# Altium schematic sheet ESC2.SchDoc: ESC
size A4; DrawnBy: BRAIN.DLL; DocumentNumber: 2; Revision: REV 1.0; SheetNumber: 2; SheetTotal: 2
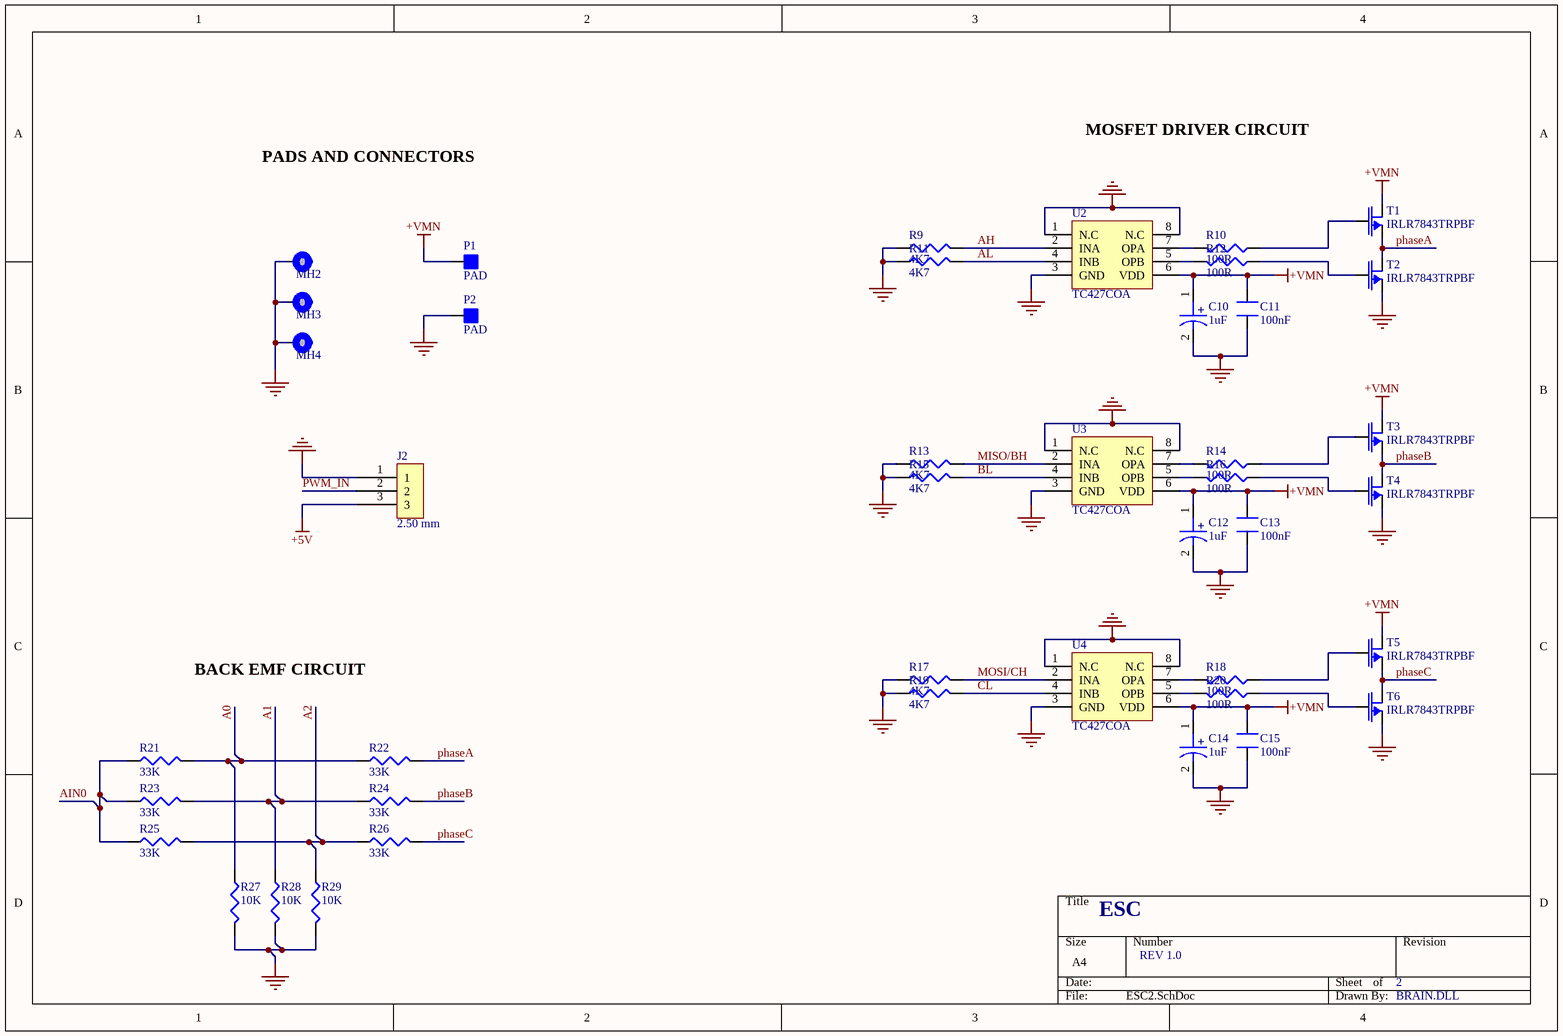
[diagram p0: ESC2.SchDoc]

## Parts
C10  1uF  [1206 TANTAL CAP]
C11  100nF  [Z0603]
C12  1uF  [1206 TANTAL CAP]
C13  100nF  [Z0603]
C14  1uF  [1206 TANTAL CAP]
C15  100nF  [Z0603]
J2  2.50 mm  [L-KLS1-XL4-2.50-03-R]
MH2  MH_7.4MMC_3.2MMD  [MH_7.4MMC_3.2MMD_NON_COPPER_NPLT]  (value not drawn)  (no BOM)
MH3  MH_7.4MMC_3.2MMD  [MH_7.4MMC_3.2MMD_NON_COPPER_NPLT]  (value not drawn)  (no BOM)
MH4  MH_7.4MMC_3.2MMD  [MH_7.4MMC_3.2MMD_NON_COPPER_NPLT]  (value not drawn)  (no BOM)
P1  PAD  [SQARE_PAD]  (no BOM)
P2  PAD  [SQARE_PAD]  (no BOM)
R9  4K7  [Z0603]
R10  100R  [Z0603]
R11  4K7  [Z0603]
R12  100R  [Z0603]
R13  4K7  [Z0603]
R14  100R  [Z0603]
R15  4K7  [Z0603]
R16  100R  [Z0603]
R17  4K7  [Z0603]
R18  100R  [Z0603]
R19  4K7  [Z0603]
R20  100R  [Z0603]
R21  33K  [Z0603]
R22  33K  [Z0603]
R23  33K  [Z0603]
R24  33K  [Z0603]
R25  33K  [Z0603]
R26  33K  [Z0603]
R27  10K  [Z0603]
R28  10K  [Z0603]
R29  10K  [Z0603]
T1  IRLR7843TRPBF  [TO-252-3]
T2  IRLR7843TRPBF  [TO-252-3]
T3  IRLR7843TRPBF  [TO-252-3]
T4  IRLR7843TRPBF  [TO-252-3]
T5  IRLR7843TRPBF  [TO-252-3]
T6  IRLR7843TRPBF  [TO-252-3]
U2  TC427COA  [SOIC-8]
U3  TC427COA  [SOIC-8]
U4  TC427COA  [SOIC-8]

## Nets
+5V: J2.3
+VMN: C10.1 C11.1 C12.1 C13.1 C14.1 C15.1 P1.1 T1.2(DRAIN) T3.2(DRAIN) T5.2(DRAIN) U2.6(VDD) U3.6(VDD) U4.6(VDD)
GND: C10.2 C11.2 C12.2 C13.2 C14.2 C15.2 J2.1 MH2.1 MH3.1 MH4.1 P2.1 R9.1 R11.1 R13.1 R15.1 R17.1 R19.1 R27.2 R28.2 R29.2 T2.3(SOURCE) T4.3(SOURCE) T6.3(SOURCE) U2.1(N.C) U2.3(GND) U2.8(N.C) U3.1(N.C) U3.3(GND) U3.8(N.C) U4.1(N.C) U4.3(GND) U4.8(N.C)
A0: R21.2 R22.1 R27.1
A1: R23.2 R24.1 R28.1
A2: R25.2 R26.1 R29.1
AH: R9.2 U2.2(INA)
AIN0: R21.1 R23.1 R25.1
AL: R11.2 U2.4(INB)
BL: R15.2 U3.4(INB)
CL: R19.2 U4.4(INB)
MISO/BH: R13.2 U3.2(INA)
MOSI/CH: R17.2 U4.2(INA)
phaseA: R22.2 T1.3(SOURCE) T2.2(DRAIN)
phaseB: R24.2 T3.3(SOURCE) T4.2(DRAIN)
phaseC: R26.2 T5.3(SOURCE) T6.2(DRAIN)
PWM_IN: J2.2
NetR10_1: R10.1 T1.1(GATE)
NetR10_2: R10.2 U2.7(OPA)
NetR12_1: R12.1 T2.1(GATE)
NetR12_2: R12.2 U2.5(OPB)
NetR14_1: R14.1 T3.1(GATE)
NetR14_2: R14.2 U3.7(OPA)
NetR16_1: R16.1 T4.1(GATE)
NetR16_2: R16.2 U3.5(OPB)
NetR18_1: R18.1 T5.1(GATE)
NetR18_2: R18.2 U4.7(OPA)
NetR20_1: R20.1 T6.1(GATE)
NetR20_2: R20.2 U4.5(OPB)

## Notes on the sheet
- PADS AND CONNECTORS
- MOSFET DRIVER CIRCUIT
- BACK EMF CIRCUIT
- (in symbol T491A105K035AT) +

## Library data of the parts
C10 C12 C14 = T491A105K035AT: Cap Tant Solid 1uF 35V A CASE 10% (3.2 X 1.6 X 1.6mm) SMD 3216-18 7.5 Ohm 125 C T/R; Manufacturer: KEMET; Dielectric Material: Tantalum; Tolerance: 20%; ESR (Equivalent Series Resistance): 7.5R; Life (Hours): 2000Hour; Dissipation Factor: 4%; Polarity: Polar; Ripple Current: 100mA; Leakage Current: 500nA; Voltage: 25V; OZDISAN_PRICE: 1.78 TRY; Supplier 1: Digi-Key; Manufacturer Part Number: T491A105K035AT; RoHS: Yes; Category: Tantalum Capacitors; Stock 1: 48; Pricing 1: 1=0,53000, 10=0,37100, 50=0,26000, 100=0,22290, 500=0,16716, 1000=0,14115 (USD); Mount: Surface Mount,PCB; Case/Package: 1206; Number of Pins: 2; Case Code (Metric): 3216; Case Code (Imperial): 1206; Min Operating Temperature: -55°C; Max Operating Temperature: 125°C; Capacitance: 1uF; Packaging: Tape and Reel; Voltage Rating: 35V; Features: General Purpose; Package Quantity: 1; Voltage Rating (DC): 35V; Failure Rate: 0.001%; Termination: SMD/SMT; Length: 3.2mm; Width: 1.6mm; Height: 1.6mm; Depth: 1.6mm; Height - Seated (Max): 0.071inch; Radiation Hardening: No; RoHS Compliant: Yes; Lead Free: Lead Free; REACH SVHC: No SVHC; ComponentLink12Description: OZDISAN_LINK; ComponentLink12URL: https://ozdisan.com/pasif-komponentler/kondansatorler/tantal-kondansatorler/T491A105K035AT; Supplier Part Number 1: 399-8265-1-ND
C11 C13 C15 = CL10B104KB8NNNC: Multi Layer Ceramic Capacitor (MLCC) / Cap Ceramic 0.1uF 50V X7R 10% Pad SMD 0603 125¡ãC T/R; Manufacturer: Samsung; OZDISAN_PRICE: 0.05 TRY; Supplier 1: RSComponents; Manufacturer Part Number: CL10B104KB8NNNC; RoHS: Yes; Category: Ceramic Capacitors; Stock 1: 17024000; Pricing 1: 4000=0,00800, 8000=0,00800, 16000=0,00800, 24000=0,00700, 40000=0,00600, 4000=0,00600, 8000=0,00600, 16000=0,00600, 24000=0,00500, 40000=0,00400 (USD); Mount: Surface Mount; Case/Package: 0603; Case Code (Metric): 1608; Case Code (Imperial): 0603; Material: Ceramic; Contact Plating: Tin; Min Operating Temperature: -55°C; Max Operating Temperature: 125°C; Capacitance: 100nF; Dielectric: X7R; Tolerance: 10%; Voltage Rating: 50V; Package Quantity: 1; Packaging: Tape and Reel; Voltage: 50V; Voltage Rating (DC): 50V; Series: CL; Construction: Flat; Length: 1.6mm; Width: 0.031inch; Height: 0.8mm; Depth: 0.8mm; Thickness: 0.035inch; Radiation Hardening: No; Lead Free: Lead Free; RoHS Compliant: Yes; Supplier Part Number 1: 7665443; ComponentLink4Description: OZDISAN_LINK; ComponentLink4URL: https://ozdisan.com/pasif-komponentler/kondansatorler/smt-smd-ve-mlcc-kondansatorler/CL10B104KB8NNNC
J2 = L-KLS1-XL4-2.50-03-R: OZDISAN_PRICE: 0,27 TRY; ComponentLink1Description: OZDISAN_LINK; ComponentLink1URL: https://ozdisan.com/konnektor-ve-baglanti-elemanlari/konnektor-cesitleri/pcb-konnektorler/L-KLS1-XL4-2-50-03-R
MH2-MH4 = MH_7.4MMNC_3.2MMD: Mounting Hole 7.4 mm Diameter (Non Copper), 3.2 mm Drill NPTH
P1 P2 = SQARE_PAD
R9 R11 R13 R15 R17 R19 = MC0603SAF4701T5E: RES, THICK FILM, 4K7, 1%, 0.1W, 0603; Resistance: 4.7kohm; Resistance Tolerance: ± 1%; Power Rating: 100mW; Resistor...; Manufacturer: Multicomp; Voltage Rating: 75V; Resistance: 4.7kR; Temperature Coefficient: 100ppm/°C; OZDISAN_PRICE: 0.02 TRY; Supplier 1: Farnell; Manufacturer Part Number: MC0603SAF4701T5E; RoHS: Yes; Category: Uncategorized; Pricing 1: 1=0,00890, 10=0,00810, 100=0,00730, 1000=0,00400 (GBP); Case/Package: 0603; Number of Pins: 2; Case Code (Metric): 1608; Case Code (Imperial): 0603; Tolerance: 1%; Resistor Type: Thick Film; Packaging: Cut Tape; Voltage Rating (DC): 75V; Resistance Tolerance: 1%; RoHS Compliant: Yes; REACH SVHC: Unknown; Supplier Part Number 1: 1632439; ComponentLink2Description: OZDISAN_LINK; ComponentLink2URL: https://ozdisan.com/pasif-komponentler/direncler/smt-smd-ve-cip-direncler/0603SAF4701T5E
R10 R12 R14 R16 R18 R20 = 0603SAJ0101T5E: OZDISAN_PRICE: 0.02 TRY; ComponentLink1Description: OZDISAN_LINK; ComponentLink1URL: https://ozdisan.com/pasif-komponentler/direncler/smt-smd-ve-cip-direncler/0603SAJ0101T5E; Case-Package: 0603
R21-R26 = RI0603L3302FT: OZDISAN_PRICE: 0.09 TRY; ComponentLink1Description: OZDISAN_LINK; ComponentLink1URL: https://ozdisan.com/pasif-komponentler/direncler/smt-smd-ve-cip-direncler/TC0325B3302T5C; Case-Package: 0603
R27-R29 = CQ03SAF1002T5E: OZDISAN_PRICE: 0.03 TRY; ComponentLink1Description: OZDISAN_LINK; ComponentLink1URL: https://ozdisan.com/pasif-komponentler/direncler/smt-smd-ve-cip-direncler/CQ03SAF1002T5E; Case-Package: 0603
T1-T6 = IRLR7843TRPBF: MOSFET, 30V, 161A, 3.3 mOhm, 34 nC Qg, Logic Level, D-Pak; Manufacturer: International Rectifier; Rise Time: 42ns; Fall Time: 19ns; Turn-Off Delay Time: 34ns; Turn-On Delay Time: 25ns; Gate to Source Voltage (Vgs): 20V; Rds On Max: 3.3mR; Input Capacitance: 4.38nF; Max Power Dissipation: 140W; Element Configuration: Single; Nominal Vgs: 2.3V; Number of Elements: 1; OZDISAN_PRICE: 14,41 TRY; Supplier 1: Allied Electronics; Manufacturer Part Number: IRLR7843TRPBF; RoHS: Yes; Category: MOSFETs; Mount: Surface Mount; Case/Package: DPAK; Number of Pins: 3; Min Operating Temperature: -55°C; Max Operating Temperature: 175°C; Continuous Drain Current (ID): 161A; Package Quantity: 1; Packaging: Cut Tape; Drain to Source Voltage (Vdss): 30V; Drain to Source Breakdown Voltage: 30V; Drain to Source Resistance: 3.3mR; Power Dissipation: 140W; Voltage Rating (DC): 30V; Current Rating: 161A; On-State Resistance: 3.3MR; Series: HEXFET®; Drain-source On Resistance-Max: 3.3MR; Length: 6.73mm; Width: 6.22mm; Height: 2.39mm; Radiation Hardening: No; RoHS Compliant: Yes; REACH SVHC: No SVHC; Lead Free: Lead Free; Supplier Part Number 1: 70017418; ComponentLink1Description: OZDISAN_LINK; ComponentLink1URL: https://www.ozdisan.com/guc-yari-iletkenleri/mosfetler/mosfet-discrete/IRLR7843TRPBF
U2-U4 = TC427COA: IC MOSFET DVR 1.5A DUAL HS 8SOIC; Manufacturer: Microchip; Number of Outputs: 2; Max Supply Voltage: 18V; Min Supply Voltage: 4.5V; Rise Time: 30ns; Propagation Delay: 75ns; Operating Supply Voltage: 16V; Max Power Dissipation: 470mW; Nominal Supply Current: 8mA; Output Impedance: 6R; OZDISAN_PRICE: 20,56 TRY; Supplier 1: Digi-Key; Manufacturer Part Number: TC427COA; RoHS: Yes; Category: Gate Drivers; Stock 1: 562; Pricing 1: 1=1,45000, 25=1,19800, 100=1,08120 (USD); Mount: Surface Mount; Case/Package: SOIC; Number of Pins: 8; Min Operating Temperature: 0°C; Max Operating Temperature: 70°C; Package Quantity: 100; Packaging: Rail/Tube; Max Output Current: 1.5A; Number of Drivers: 2; Fall Time: 30ns; Power Dissipation: 470mW; Max Supply Current: 8mA; Turn-On Delay Time: 75ns; Supply Current: 8mA; Series: -; Length: 4.9mm; Width: 3.91mm; Height: 1.42mm; Radiation Hardening: No; Lead Free: Lead Free; RoHS Compliant: Yes; REACH SVHC: No SVHC; Supplier Part Number 1: TC427COA-ND; ComponentLink5Description: OZDISAN_LINK; ComponentLink5URL: https://ozdisan.com/entegre-devreler-ics/guc-entegreleri/guc-surucu-entegreleri/TC427COA